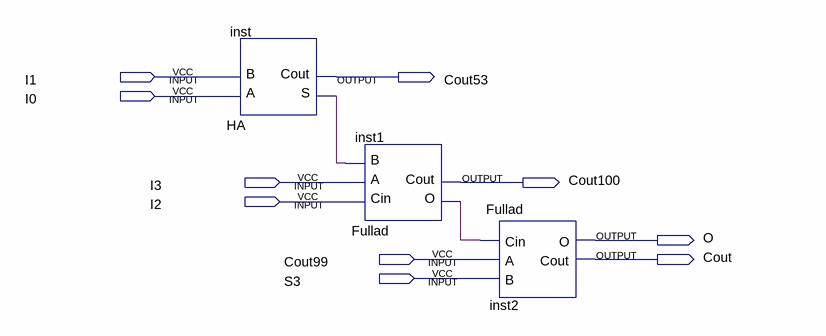
[diagram p0: schematic sheet]
// Quartus schematic B6.bdf as structural Verilog: 3 symbols, 10 pins
module B6 (
  input  I1,
  input  I0,
  input  I3,
  input  I2,
  input  Cout99,
  input  S3,
  output Cout53,
  output Cout100,
  output O,
  output Cout
);

  wire inst1_o, inst_s;

  HA inst (.A(I0), .B(I1), .S(inst_s), .Cout(Cout53));
  Fullad inst1 (.Cin(I2), .A(I3), .B(inst_s), .O(inst1_o), .Cout(Cout100));
  Fullad inst2 (.Cin(inst1_o), .A(Cout99), .B(S3), .O(O), .Cout(Cout));
endmodule
